# EAGLE design opamp-only (EAGLE 8.3.1)
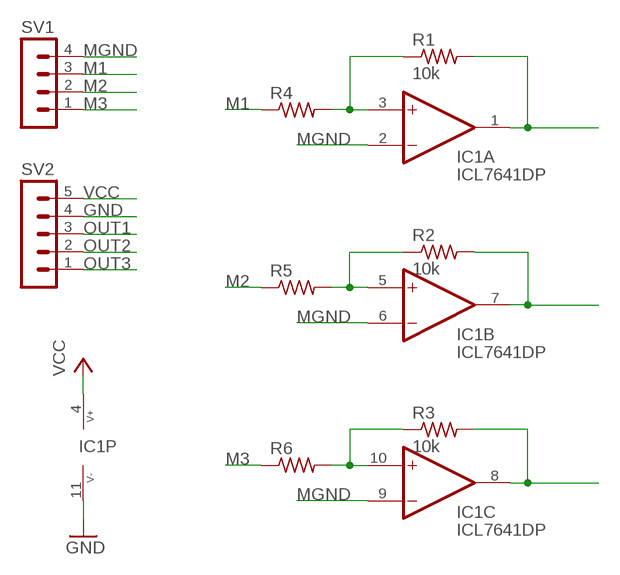
[diagram p0: schematic, sheet 1]

## Parts
IC1  ICL7641DP  [DIL14]
R1  10k  R-US_0207/7  [0207/7]
R2  10k  R-US_0207/7  [0207/7]
R3  10k  R-US_0207/7  [0207/7]
R4  R-US_0207/7  [0207/7]
R5  R-US_0207/7  [0207/7]
R6  R-US_0207/7  [0207/7]
SV1  MA04-1  [MA04-1]
SV2  MA05-1  [MA05-1]

## Nets
GND: IC1.11(P:V-) SV2.4
I1: IC1.3(A:+IN) R1.1 R4.2
I2: IC1.5(B:+IN) R2.1 R5.2
I3: IC1.10(C:+IN) R3.1 R6.2
M1: R4.1 SV1.3
M2: R5.1 SV1.2
M3: R6.1 SV1.1
MGND: IC1.2(A:-IN) IC1.6(B:-IN) IC1.9(C:-IN) SV1.4
OUT1: IC1.1(A:OUT) R1.2 SV2.3
OUT2: IC1.7(B:OUT) R2.2 SV2.2
OUT3: IC1.8(C:OUT) R3.2 SV2.1
VCC: IC1.4(P:V+) SV2.5
Unconnected: IC1.12(D:+IN) IC1.13(D:-IN) IC1.14(D:OUT)

## Library data of the parts
IC1 = maxim:ICL764*: Quad Operational Amplifiers Source: http://datasheets.maxim-ic.com/en/ds/ICL7612-ICL764X.pdf; OC_FARNELL: unknown; OC_NEWARK: unknown
R1-R6 = rcl:R-US_: RESISTOR, American symbol
SV1 = con-lstb:MA04-1: PIN HEADER; OC_FARNELL: unknown; OC_NEWARK: unknown
SV2 = con-lstb:MA05-1: PIN HEADER; OC_FARNELL: unknown; OC_NEWARK: unknown

## Board
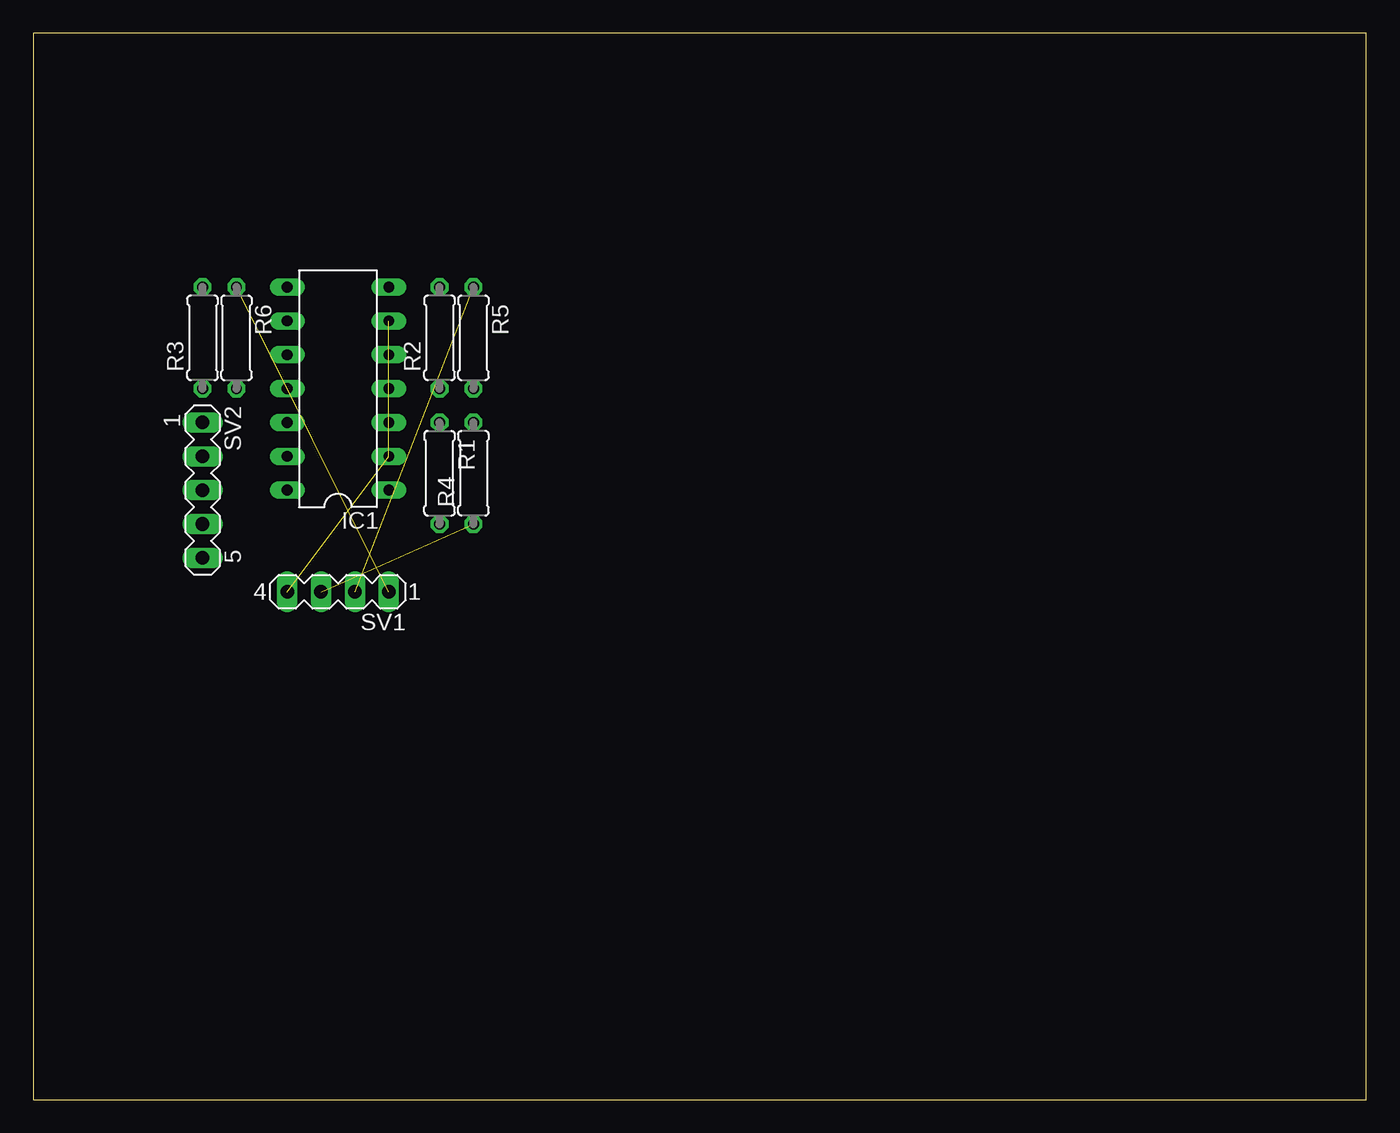
[diagram p1: board, top side]
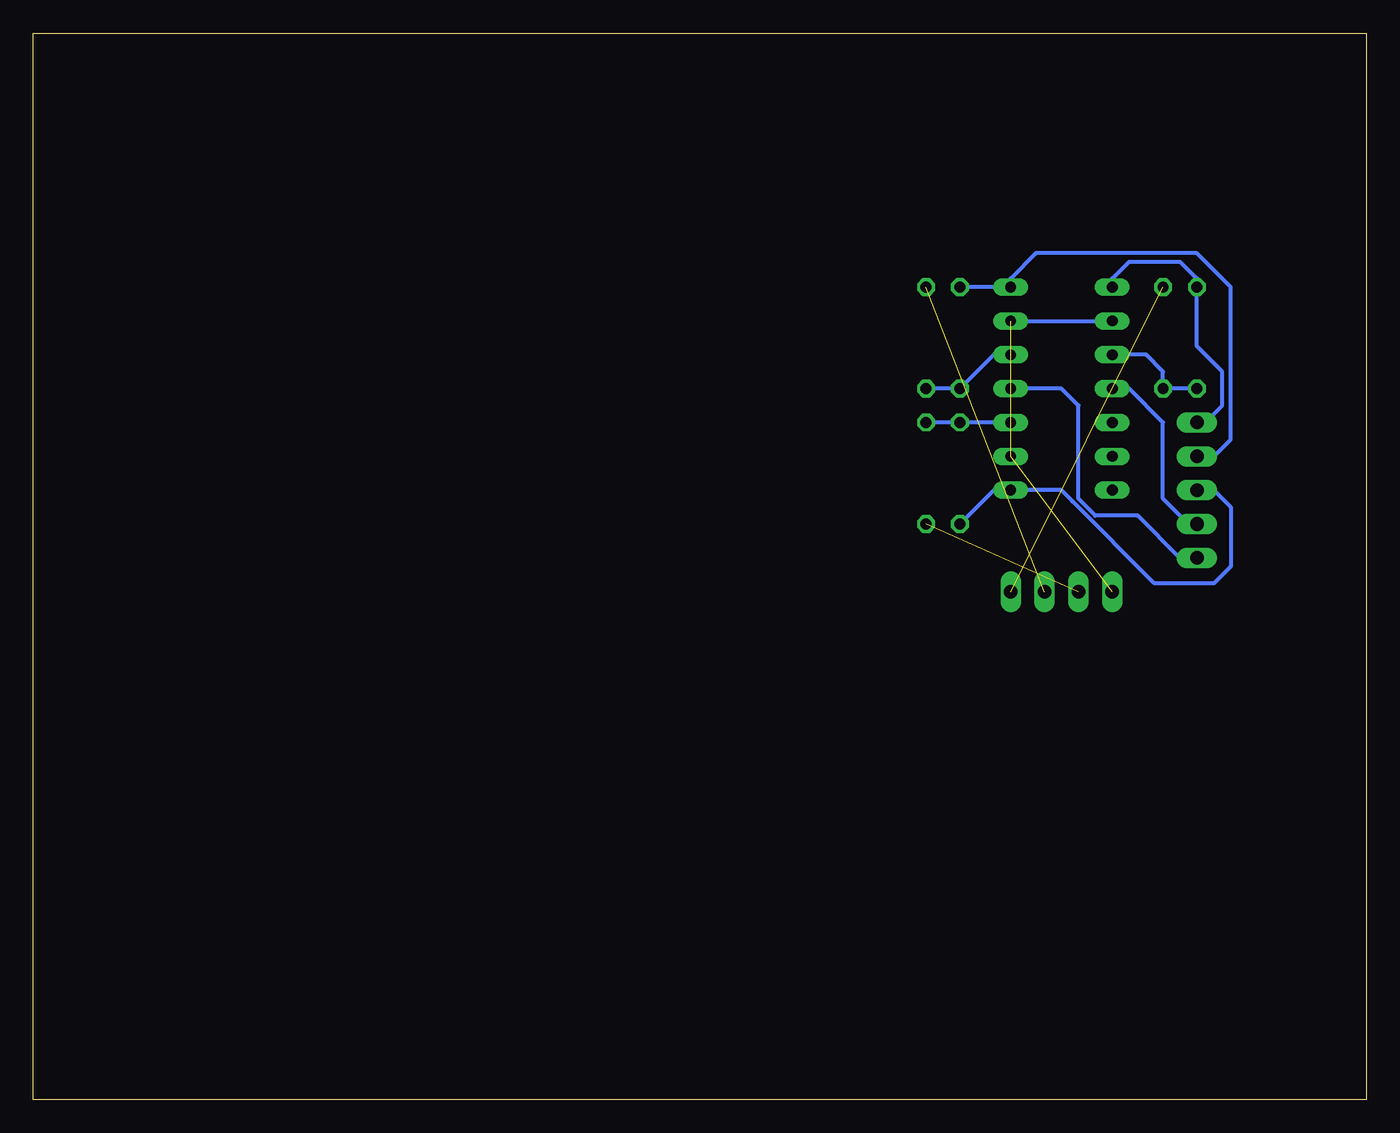
[diagram p2: board, bottom side, seen from below]

Size 100 x 80 mm. Coordinates in mm from the lower left corner, seen from the top.
Outline: 0,0 100,0 100,80 0,80 0,0
Copper layers (1*16): Top 0.035mm / dielectric 1.5mm / Bottom 0.035mm
Design rules "default": minimum track width 6mil, minimum drill 0.35mm, track to track 6mil, track to pad 6mil, pad to pad 6mil, via to via 6mil, smd to smd 6mil, copper to edge 40mil, drill to drill 6mil, minimum pad ring 10mil, minimum via ring 8mil, stop-mask expansion 4mil, vias tented up to drill 0mil, thermal gap 10mil

### Footprints (pad centres in the part's own frame; a part is rotated, then mirrored left to right if it is on the bottom)
DIL14 = drill 0.813 long: 1 -7.62,-3.81; 2 -5.08,-3.81; 3 -2.54,-3.81; 4 0,-3.81; 5 2.54,-3.81; 6 5.08,-3.81; 7 7.62,-3.81; 8 7.62,3.81; 9 5.08,3.81; 10 2.54,3.81; 11 0,3.81; 12 -2.54,3.81; 13 -5.08,3.81; 14 -7.62,3.81
0207/7 = drill 0.813 octagon: 1 -3.81,0; 2 3.81,0
MA04-1 = drill 1.016 long: 1 -3.81,0; 2 -1.27,0; 3 1.27,0; 4 3.81,0
MA05-1 = drill 1.016 long: 1 -5.08,0; 2 -2.54,0; 3 0,0; 4 2.54,0; 5 5.08,0

### Placement (x,y rotation side)
IC1  22.86,53.34 90 top
R1  30.48,46.99 270 top
R2  30.48,57.15 90 top
R3  12.7,57.15 90 top
R4  33.02,46.99 90 top
R5  33.02,57.15 270 top
R6  15.24,57.15 270 top
SV1  22.86,38.1 180 top
SV2  12.7,45.72 270 top

### Tracks (layer width: path | path; a pad name or v marks a point on that pad's centre or on a via)
GND
  Bottom 0.305: SV2.4 13.34,43.18 15.24,45.09 15.24,50.8 17.78,53.34 IC1.11
I1
  Bottom 0.305: IC1.3 R1.1 R4.2
I2
  Bottom 0.305: IC1.5 27.94,55.88 R2.1 R5.2
I3
  Bottom 0.305: R3.1 R6.2 15.24,54.61 16.51,55.88 IC1.10
M1  (1 unrouted)
M2  (1 unrouted)
M3  (1 unrouted)
MGND  (2 unrouted)
  Bottom 0.305: IC1.6 IC1.9
OUT1
  Bottom 0.305: R1.2 27.94,45.72 IC1.1 22.86,45.72 22.05,44.91 22.05,44.9 15.89,38.73 11.43,38.73 10.16,40.01 10.16,44.45 11.43,45.72 SV2.3
OUT2
  Bottom 0.305: SV2.2 11.43,48.26 10.16,49.53 10.16,60.96 12.7,63.5 24.77,63.5 26.67,61.59 IC1.7 R2.2
OUT3
  Bottom 0.305: IC1.8 19.05,61.59 17.78,62.87 13.97,62.87 12.7,61.59 R3.2 12.7,56.52 10.79,54.61 10.79,52.07 12.06,50.8 | 12.06,50.8 SV2.1 12.06,50.8
VCC
  Bottom 0.305: SV2.5 13.97,40.64 17.14,43.81 20.32,43.81 21.59,45.09 21.59,52.07 22.86,53.34 IC1.4